# Altium schematic sheet 3V3 NCP1117DT33G.SchDoc
size A4; Author: Wojciech Grędel; CompanyName: AGH Racing; DocumentNumber: 7; Revision: 4; SheetNumber: 1; SheetTotal: 1; CarNumber: 6; ProjectName: Project Name
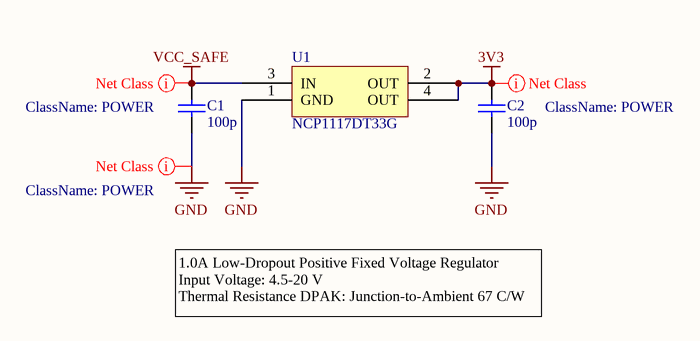
[diagram p0: 3V3 NCP1117DT33G.SchDoc]

## Parts
C1  value 100p  [CAP_0603_IPC_MD]  (hidden comment: Cap)
C2  value 100p  [CAP_0603_IPC_MD]  (hidden comment: Cap)
U1  NCP1117DT33G  [DPAK_IPC_MD]

## Nets
3V3: C2.2 U1.2(OUT) U1.4(OUT)
GND: C1.1 C2.1 U1.1(GND)
VCC_SAFE: C1.2 U1.3(IN)

## Layout directives
net class POWER: 3V3, GND, VCC_SAFE

## Notes on the sheet
- 1.0A Low-Dropout Positive Fixed Voltage Regulator
  Input Voltage: 4.5-20 V
  Thermal Resistance DPAK: Junction-to-Ambient 67 C/W
- Confidential / Not for distribution !
- Document name:
- Designer Name:
- Date/Time:
- Revision:

## Library data of the parts
C1 C2 = Cap: Capacitor